# EAGLE design Button (EAGLE 7.4.0)
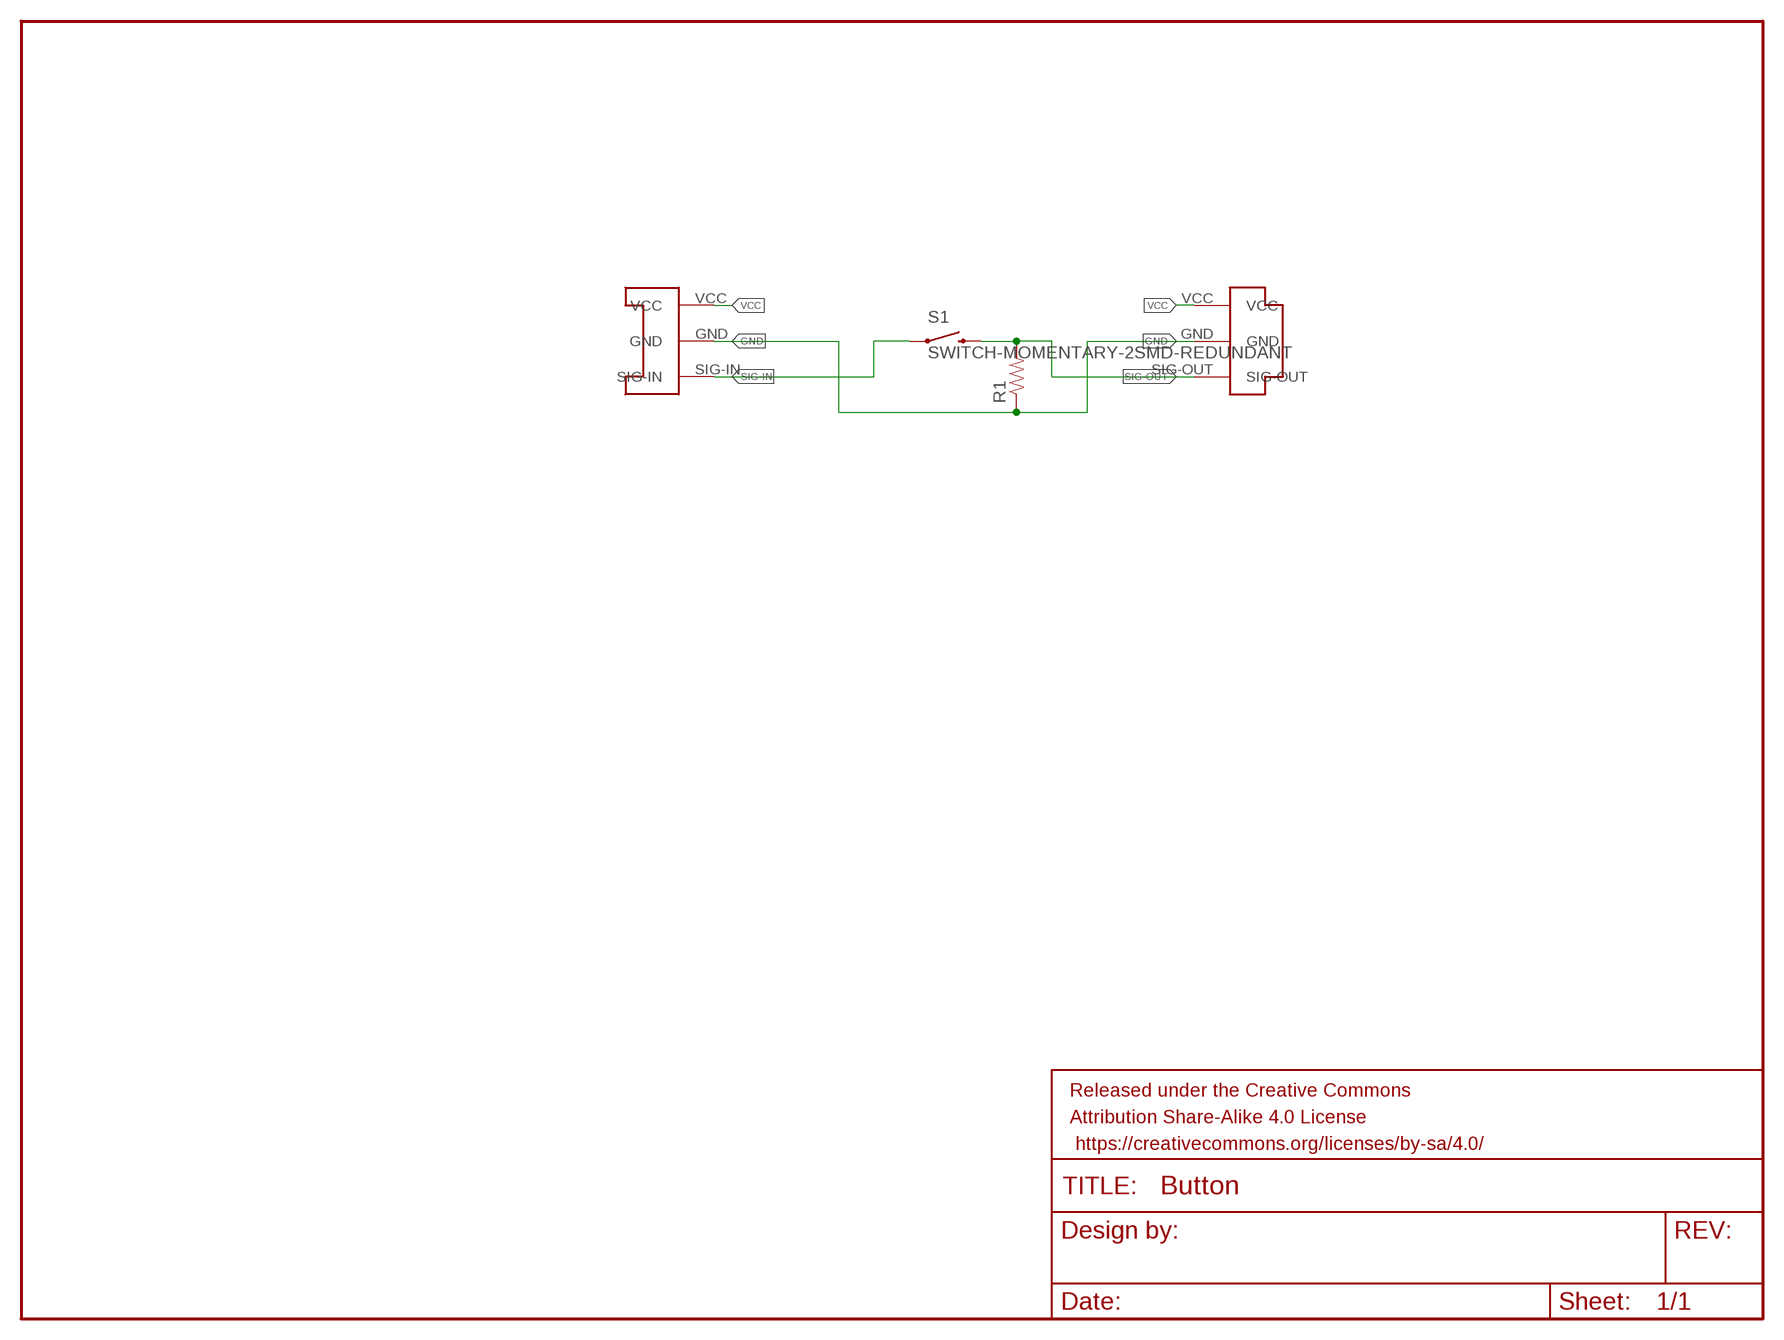
[diagram p0: schematic, sheet 1]

## Parts
FRAME1  FRAME-LETTERNO_PACKAGE  [DUMMY]
R1  RESISTOR0603  [0603-RES]
S1  SWITCH-MOMENTARY-2SMD-REDUNDANT  [TACTILE-SWITCH-SMD]
U$1  CONN-PLUG-3POS-3MM  [PLUG-3POS-3MM-SMD]
U$2  CONN-SOCKET-3POS-3MM  [SOCKET-3POS-3MM-SMD]

## Nets
GND: R1.1 U$1.GND U$2.GND
SIG-IN: S1.1 S1.2 U$2.SIG-IN
SIG-OUT: R1.2 S1.3 S1.4 U$1.SIG-OUT
VCC: U$1.VCC U$2.VCC

## Library data of the parts
FRAME1 = SparkFun-Aesthetics:FRAME-LETTER: Schematic Frame Standard 8.5x11 US Letter frame; DESIGNER: Nobody; VERSION: v01
R1 = SparkFun-Resistors:RESISTOR: Resistor Basic schematic elements and footprints for 0603, 1206, and PTH resistors.
S1 = SparkFun-Electromechanical:SWITCH-MOMENTARY-2: Various NO switches- pushbuttons, reed, etc; PROD_ID: SWCH-08247
U$1 = EmbeddedPlayground:CONN-PLUG-3POS-3MM: Surface mount board to board connector. Female socket, 3 position.
U$2 = EmbeddedPlayground:CONN-SOCKET-3POS-3MM: Surface mount board to board connector. Female socket, 3 position.

## Board
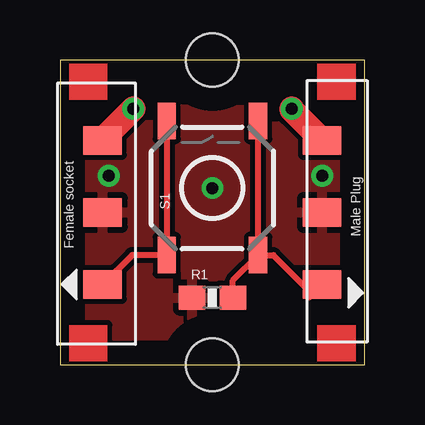
[diagram p1: board, top side]
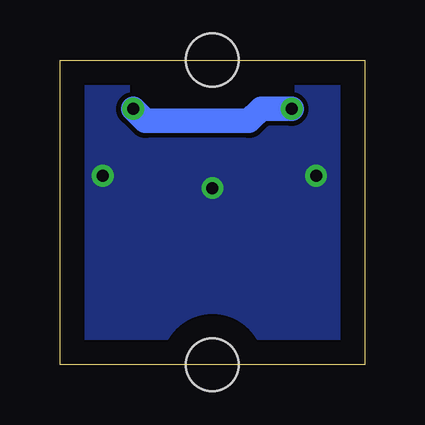
[diagram p2: board, bottom side, seen from below]

Size 12.7 x 12.7 mm. Coordinates in mm from the lower left corner, seen from the top.
Outline: 0,0 12.7,0 12.7,12.7 0,12.7 0,0
Copper layers (1*16): Top 0.035mm / dielectric 1.5mm / Bottom 0.035mm
Design rules "default": minimum track width 10mil, minimum drill 24mil, track to track 8mil, track to pad 8mil, pad to pad 8mil, via to via 8mil, smd to smd 8mil, copper to edge 40mil, drill to drill 8mil, minimum pad ring 10mil, minimum via ring 8mil, stop-mask expansion 4mil, vias tented up to drill 0mil, thermal gap 10mil
Holes 2.2 mm at 6.35,12.7 6.35,0

### Footprints (pad centres in the part's own frame; a part is rotated, then mirrored left to right if it is on the bottom)
0603-RES = smd 1.1 x 1: 1 -0.85,0; 2 0.85,0
TACTILE-SWITCH-SMD = smd 1.524 x 0.762: 1 -2.794,1.905; 2 2.794,1.905; 3 -2.794,-1.905; 4 2.794,-1.905
PLUG-3POS-3MM-SMD = smd 1.2 x 1.6: GND 0,0; SIG-OUT 3,0; VCC -3,0
SOCKET-3POS-3MM-SMD = smd 1.2 x 1.6: GND 0,0; SIG-IN -3,0; VCC 3,0

### Placement (x,y rotation side)
FRAME1  0,0 0 top
R1  6.35,2.79 0 top
S1  6.35,7.37 90 top
U$1  10.92,6.35 270 top
U$2  1.78,6.35 90 top

### Tracks (layer width: path | path; a pad name or v marks a point on that pad's centre or on a via)
GND  (via drill 0.5)
  other vias: 2.03,7.87 6.35,7.37 10.92,7.87
  pour Top: 0,13.97 0,-1.27 26.67,-1.27 26.67,13.97
  pour Bottom: -1.27,13.97 26.67,13.97 26.67,-2.54 -1.27,-2.54
N$2  (via drill 0.5)
  other vias: 3.05,10.67
N$4  (via drill 0.5)
  other vias: 9.65,10.67
SIG-IN
  Top 0.254: S1.2 S1.1 3,4.57 U$2.SIG-IN
SIG-OUT
  Top 0.254: S1.3 S1.4 | 10.37,2.79 10.52,2.94 | 10.52,2.94 U$1.SIG-OUT | R1.2 7.2,3.52 S1.3 | S1.3 8.89,4.57 10.52,2.94
  Top 0.406: 10.92,3.56 U$1.SIG-OUT
VCC  (via drill 0.5)
  Top 1.016: U$2.VCC 1.78,9.4 v3.05,10.67 | v9.65,10.67 9.65,10.62 U$1.VCC
  Bottom 1.016: v3.05,10.67 4.32,10.67 4.83,10.16 9.14,10.16 v9.65,10.67